# EAGLE design xbee arriba (EAGLE 9.3.1)
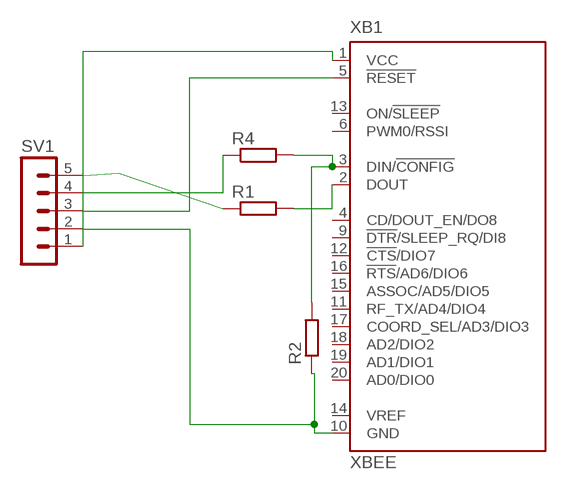
[diagram p0: schematic, sheet 1]

## Parts
R1  R-EU_0204/7  [0204/7]
R2  R-EU_0204/7  [0204/7]
R4  R-EU_0204/7  [0204/7]
SV1  MA05-1  [MA05-1]
XB1  XBEE  [XBEE]

## Nets
N$1: R2.1 SV1.2 XB1.10(GND)
N$2: R4.1 SV1.4
N$3: R2.2 R4.2 XB1.3(DIN/!CONFIG)
N$4: R1.1 SV1.5
N$5: R1.2 XB1.2(DOUT)
N$6: SV1.3 XB1.5(!RESET)
N$7: SV1.1 XB1.1(VCC)
Unconnected: XB1.4(CD/DOUT_EN/DO8) XB1.6(PWM0/RSSI) XB1.9(!DTR!/SLEEP_RQ/DI8) XB1.11(RF_TX/AD4/DIO4) XB1.12(!CTS!/DIO7) XB1.13(ON/!SLEEP) XB1.14(VREF) XB1.15(ASSOC/AD5/DIO5) XB1.16(!RTS!/AD6/DIO6) XB1.17(COORD_SEL/AD3/DIO3) XB1.18(AD2/DIO2) XB1.19(AD1/DIO1) XB1.20(AD0/DIO0)

## Library data of the parts
R1 R2 R4 = resistor:R-EU_: RESISTOR, European symbol
SV1 = con-lstb:MA05-1: PIN HEADER; OC_FARNELL: unknown; OC_NEWARK: unknown
XB1 = maxstream:XBEE: XBee (TM) /XBee-PRO(TM) OEM RF Modules Source: MaxStream, Inc. xbee_productmanual.pdf; MPN: XBP24-Z7UIT-004; OC_FARNELL: 1751799; OC_NEWARK: 34R5507

## Board
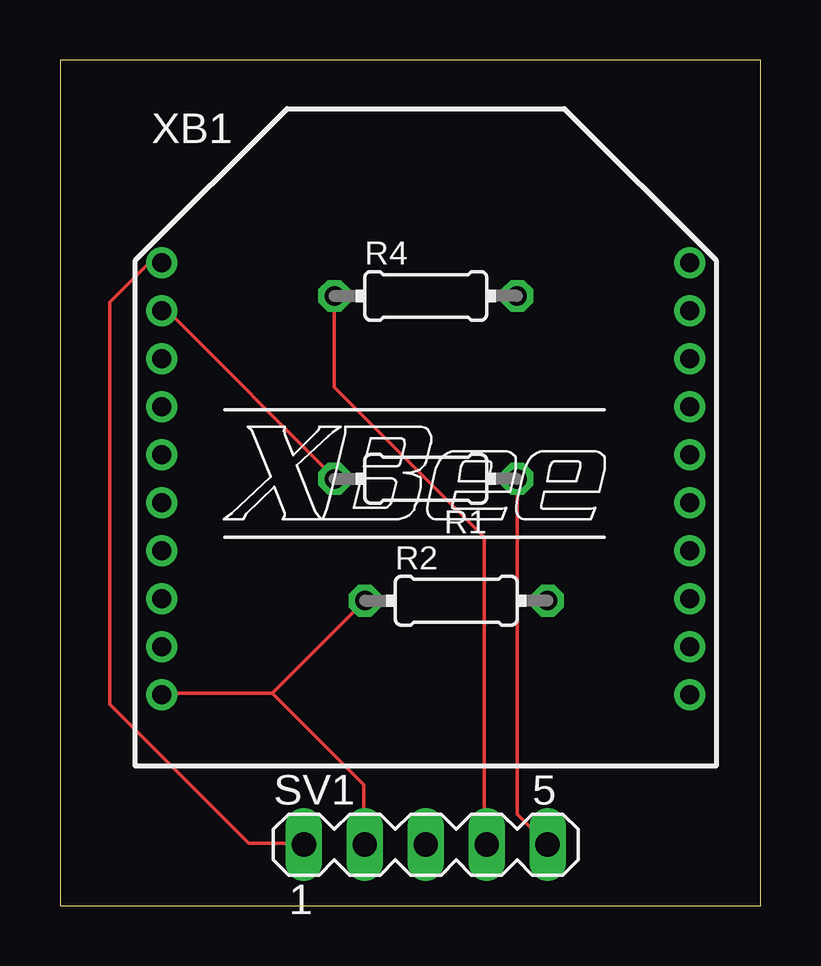
[diagram p1: board, top side]
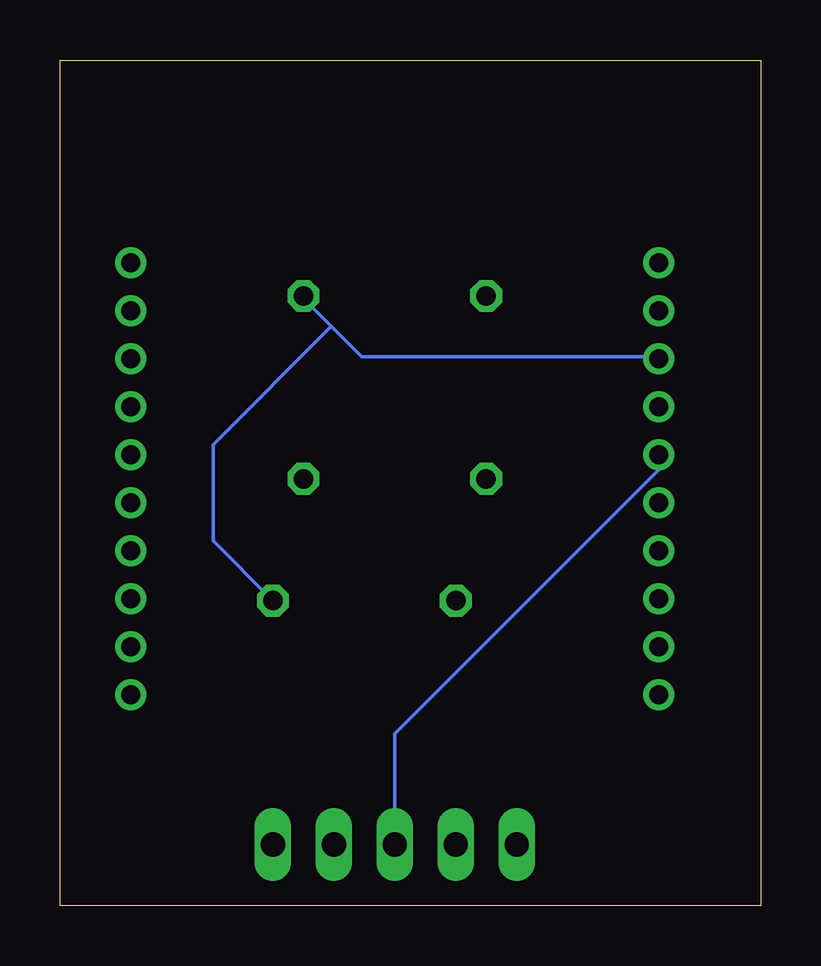
[diagram p2: board, bottom side, seen from below]

Size 29.19 x 35.23 mm. Coordinates in mm from the lower left corner, seen from the top.
Outline: 0,0 29.19,0 29.19,35.23 0,35.23 0,0
Copper layers (1*16): Top 0.035mm / dielectric 1.5mm / Bottom 0.035mm
Design rules "default": minimum track width 6mil, minimum drill 0.35mm, track to track 6mil, track to pad 6mil, pad to pad 6mil, via to via 6mil, smd to smd 6mil, copper to edge 40mil, drill to drill 6mil, minimum pad ring 10mil, minimum via ring 8mil, stop-mask expansion 4mil, vias tented up to drill 0mil, thermal gap 10mil

### Footprints (pad centres in the part's own frame; a part is rotated, then mirrored left to right if it is on the bottom)
0204/7 = drill 0.813 octagon: 1 -3.81,0; 2 3.81,0
MA05-1 = drill 1.016 long: 1 -5.08,0; 2 -2.54,0; 3 0,0; 4 2.54,0; 5 5.08,0
XBEE = drill 0.8 pad 1.27: 1 -11,9; 2 -11,7; 3 -11,5; 4 -11,3; 5 -11,1; 6 -11,-1; 7 -11,-3; 8 -11,-5; 9 -11,-7; 10 -11,-9; 11 11,-9; 12 11,-7; 13 11,-5; 14 11,-3; 15 11,-1; 16 11,1; 17 11,3; 18 11,5; 19 11,7; 20 11,9

### Placement (x,y rotation side)
R1  15.24,17.78 180 top
R2  16.51,12.7 0 top
R4  15.24,25.4 0 top
SV1  15.24,2.54 0 top
XB1  15.24,17.78 0 top

### Tracks (layer width: path | path; a pad name or v marks a point on that pad's centre or on a via)
N$1
  Top 0.152: 8.84,8.84 4.27,8.84 XB1.10 | R2.1 8.84,8.84 | 8.84,8.84 12.65,5.03 12.65,2.59 SV1.2
N$2
  Top 0.152: R4.1 11.43,21.59 17.68,15.34 17.68,2.59 SV1.4
N$3
  Bottom 0.152: 17.88,24.13 19.05,25.3 R4.2 | 17.88,24.13 16.61,22.86 4.27,22.86 XB1.3 | R2.2 22.81,15.19 22.81,19.2 17.88,24.13
N$4
  Top 0.152: R1.1 19.05,3.81 SV1.5
N$5
  Top 0.152: XB1.2 4.27,24.69 4.57,24.69 11.43,17.83 R1.2
N$6
  Bottom 0.152: SV1.3 15.24,7.16 4.27,18.14 4.27,18.75 XB1.5
N$7
  Top 0.152: XB1.1 3.72,26.78 2.08,25.15 2.08,8.38 7.87,2.59 10.06,2.59 SV1.1